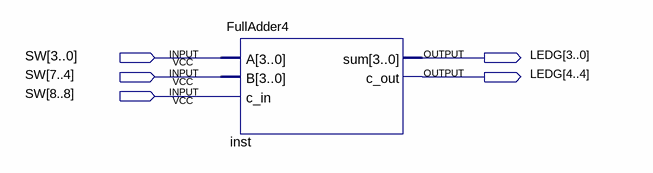
[diagram p0: schematic sheet]
// Quartus schematic block_adder_4.bdf as structural Verilog: 1 symbols, 5 pins
module block_adder_4 (
  input  [8:0] SW,
  output [4:0] LEDG
);

  FullAdder4 inst (.A(SW[3:0]), .B(SW[7:4]), .c_in(SW[8]), .sum(LEDG[3:0]), .c_out(LEDG[4]));
endmodule
